# EAGLE design DED-Adapters (EAGLE 7.0.0)
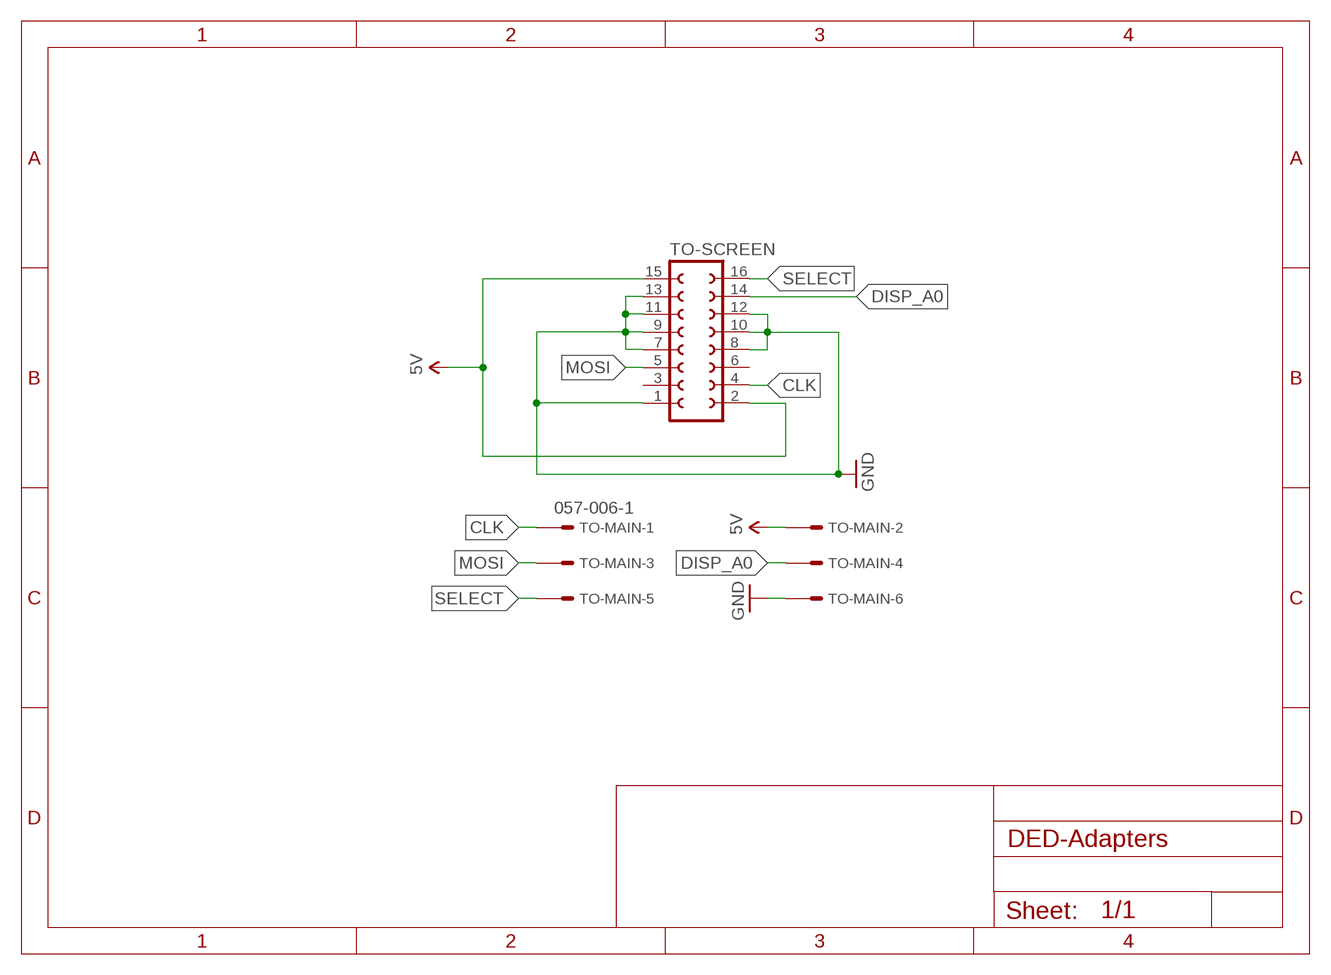
[diagram p0: schematic, sheet 1]

## Parts
TO-MAIN  057-006-1  [057-006-1]
TO-SCREEN  FE08-2  [FE08-2]

## Nets
5V [Power]: TO-MAIN.2 TO-SCREEN.2 TO-SCREEN.15
CLK [Signal]: TO-MAIN.1 TO-SCREEN.4
DISP_A0 [Signal]: TO-MAIN.4 TO-SCREEN.14
GND [Power]: TO-MAIN.6 TO-SCREEN.1 TO-SCREEN.7 TO-SCREEN.8 TO-SCREEN.9 TO-SCREEN.10 TO-SCREEN.11 TO-SCREEN.12 TO-SCREEN.13
MOSI [Signal]: TO-MAIN.3 TO-SCREEN.5
SELECT [Signal]: TO-MAIN.5 TO-SCREEN.16
Unconnected: TO-SCREEN.3 TO-SCREEN.6

## Library data of the parts
TO-MAIN = con-panduit:057-006-: CONNECTOR 6-pin series 057 contact pc board low profile headers; OC_FARNELL: unknown; OC_NEWARK: unknown
TO-SCREEN = con-lsta:FE08-2: FEMALE HEADER; OC_FARNELL: unknown; OC_NEWARK: unknown

## Net classes
1 Power: width 0.381 mm, drill 0.381 mm, clearance 0.381 mm
2 Signal: width 0.254 mm, drill 0.254 mm, clearance 0.254 mm

## Board
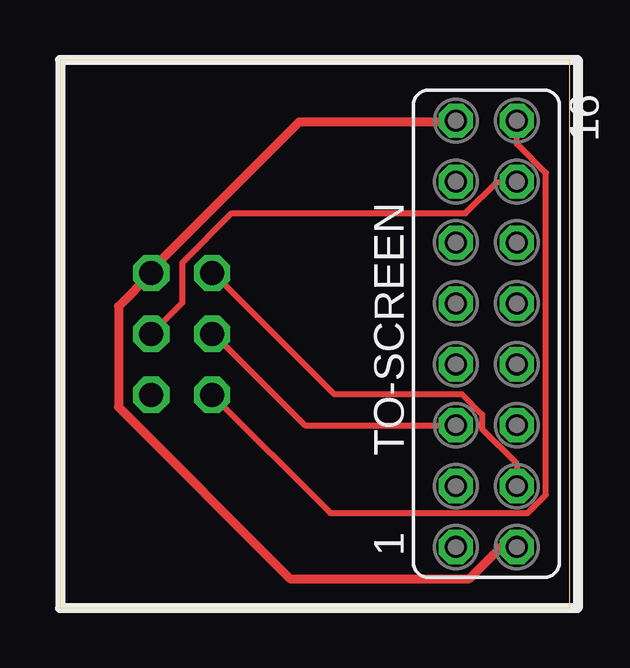
[diagram p1: board, top side]
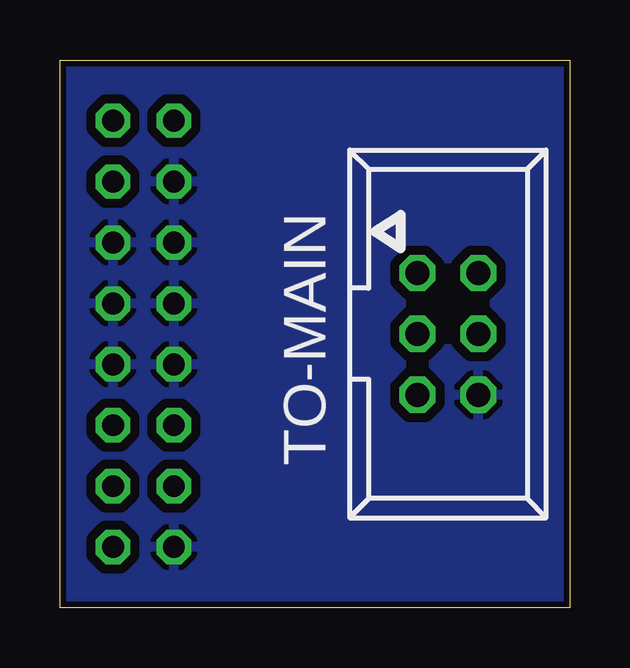
[diagram p2: board, bottom side, seen from below]

Size 21.26 x 22.85 mm. Coordinates in mm from the lower left corner, seen from the top.
Outline: 0,0 21.26,0 21.26,22.85 0,22.85 0,0
Copper layers (1*16): Top 0.035mm / dielectric 1.5mm / Bottom 0.035mm
Design rules "ITEADstudio_DRC": minimum track width 6mil, minimum drill 12mil, track to track 6mil, track to pad 6mil, pad to pad 6mil, via to via 6mil, smd to smd 0mil, copper to edge 10mil, drill to drill 10mil, minimum pad ring 10mil, minimum via ring 6mil, stop-mask expansion 2mil, vias tented up to drill 100mil, thermal gap 10mil

### Footprints (pad centres in the part's own frame; a part is rotated, then mirrored left to right if it is on the bottom)
057-006-1 = drill 1 octagon: 1 -2.54,-1.27; 2 -2.54,1.27; 3 0,-1.27; 4 0,1.27; 5 2.54,-1.27; 6 2.54,1.27
FE08-2 = drill 0.914 octagon: 1 -8.89,1.27; 2 -8.89,-1.27; 3 -6.35,1.27; 4 -6.35,-1.27; 5 -3.81,1.27; 6 -3.81,-1.27; 7 -1.27,1.27; 8 -1.27,-1.27; 9 1.27,1.27; 10 1.27,-1.27; 11 3.81,1.27; 12 3.81,-1.27; 13 6.35,1.27; 14 6.35,-1.27; 15 8.89,1.27; 16 8.89,-1.27

### Placement (x,y rotation side)
TO-MAIN  5.08,11.43 270 bottom
TO-SCREEN  17.78,11.43 90 top

### Tracks (layer width: path | path; a pad name or v marks a point on that pad's centre or on a via)
5V
  Top 0.381: TO-SCREEN.2 19.05,2.52 18.36,2.52 17.07,1.22 9.6,1.22 2.44,8.38 2.44,12.57 3.81,13.95 TO-MAIN.2 3.81,14.1 9.98,20.27 16.46,20.27 TO-SCREEN.15
CLK
  Top 0.254: TO-SCREEN.4 19.05,6.02 17.6,7.47 17.6,8.08 16.76,8.91 11.43,8.91 6.4,13.95 TO-MAIN.1
DISP_A0
  Top 0.254: TO-MAIN.4 5.11,12.72 5.11,14.4 7.16,16.46 16.92,16.46 18.21,17.75 19.05,17.75 TO-SCREEN.14
GND
  pour Bottom: -1.27,24.13 22.86,24.13 22.86,-1.27 -1.27,-1.27
MOSI
  Top 0.254: TO-SCREEN.5 10.21,7.62 6.4,11.43 TO-MAIN.3
SELECT
  Top 0.254: TO-SCREEN.16 19.05,19.36 20.27,18.14 20.27,4.72 19.51,3.96 11.28,3.96 TO-MAIN.5